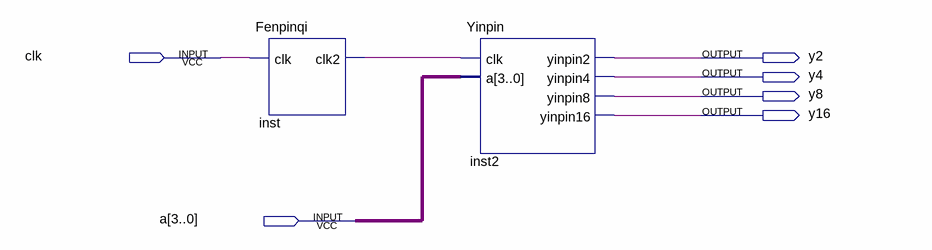
[diagram p0: schematic sheet]
// Quartus schematic voice.bdf as structural Verilog: 2 symbols, 6 pins
module voice (
  input  clk,
  input  [3:0] a,
  output y2,
  output y4,
  output y8,
  output y16
);

  wire inst_clk2;

  Fenpinqi inst (.clk(clk), .clk2(inst_clk2));
  Yinpin inst2 (.clk(inst_clk2), .a(a), .yinpin2(y2), .yinpin4(y4), .yinpin8(y8), .yinpin16(y16));
endmodule
